# Altium schematic sheet USB_Connector.SchDoc: Title
size A4; Date: *******; ApprovedBy: *******; CheckedBy: None; Author: *******; CompanyName: *******; DrawnBy: Name; Engineer: *******; Organization: *******; Address1: *******; Address2: *******; Address3: *******; Address4: *******; DocumentNumber: 10; Revision: *******; SheetNumber: 10; SheetTotal: 11; CurrentTime: *******; CurrentDate: *******; Time: *******; DocumentFullPathAndName: *******; DocumentName: *******; ModifiedDate: *******; ImagePath: *******; ProjectName: *******; Application_BuildNumber: *******
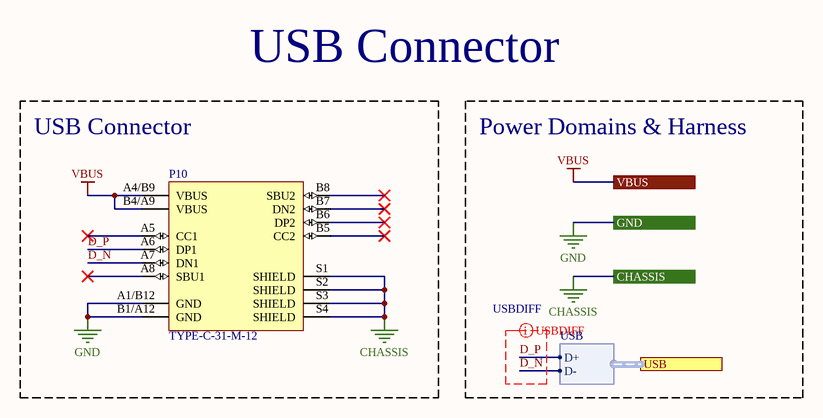
[diagram p0: USB_Connector.SchDoc]

## Parts
P10  TYPE-C-31-M-12  [TYPE-C-31-M-12]

## Blocks framed on the sheet
USB Connector: P10

## Ports
CHASSIS (see Lens-Maker[2B], ESP32_Block[3D], Mechanical_Holes[3C]), GND (see Lens-Maker[1B], A4988[3B], ESP32_Block[3D], ESP32_Module[3B], GPIO_Header[3B], I2C_Header[3B], Mechanical_Holes[3B], Power[3C], SPI_Header[3B], Stepper_Driver[3B]), USB (harness USB, see Lens-Maker[2B], ESP32_Block[3C], ESP32_Module[2B]), VBUS (see Lens-Maker[1B], ESP32_Block[3C], ESP32_Module[4B], Power[3B])

## Harnesses
USB: D+, D-

## Nets
CHASSIS: P10.S1(SHIELD) P10.S2(SHIELD) P10.S3(SHIELD) P10.S4(SHIELD) ; port CHASSIS
GND: P10.A1/B12(GND) P10.B1/A12(GND) ; port GND
VBUS: P10.A4/B9(VBUS) P10.B4/A9(VBUS) ; port VBUS
D_N: P10.A7(DN1) ; port USB.D-
D_P: P10.A6(DP1) ; port USB.D+

Not connected (* = marked no-connect by the designer): P10 A5(CC1)* A8(SBU1)* B5(CC2)* B6(DP2)* B7(DN2)* B8(SBU2)*

## Layout directives
differential pair; differential pair class USBDIFF: D_N, D_P

## Notes on the sheet
- USB Connector
- Power Domains & Harness
- Title:
- Size:
- Date:
- Drawn By:
- Page Contents:
- A4
- Checked By:
- Revision:
- Sheet
- of

## Library data of the parts
P10 = TYPE-C-31-M-12: USB C SMD Connector; Manufacturer: Korean Hroparts Elec; Supplier: JLCPCB; Supplier Part Number: C165948; Manufacturer Part Number: TYPE-C-31-M-12